# EAGLE design HexJacks (EAGLE 6.6.0)
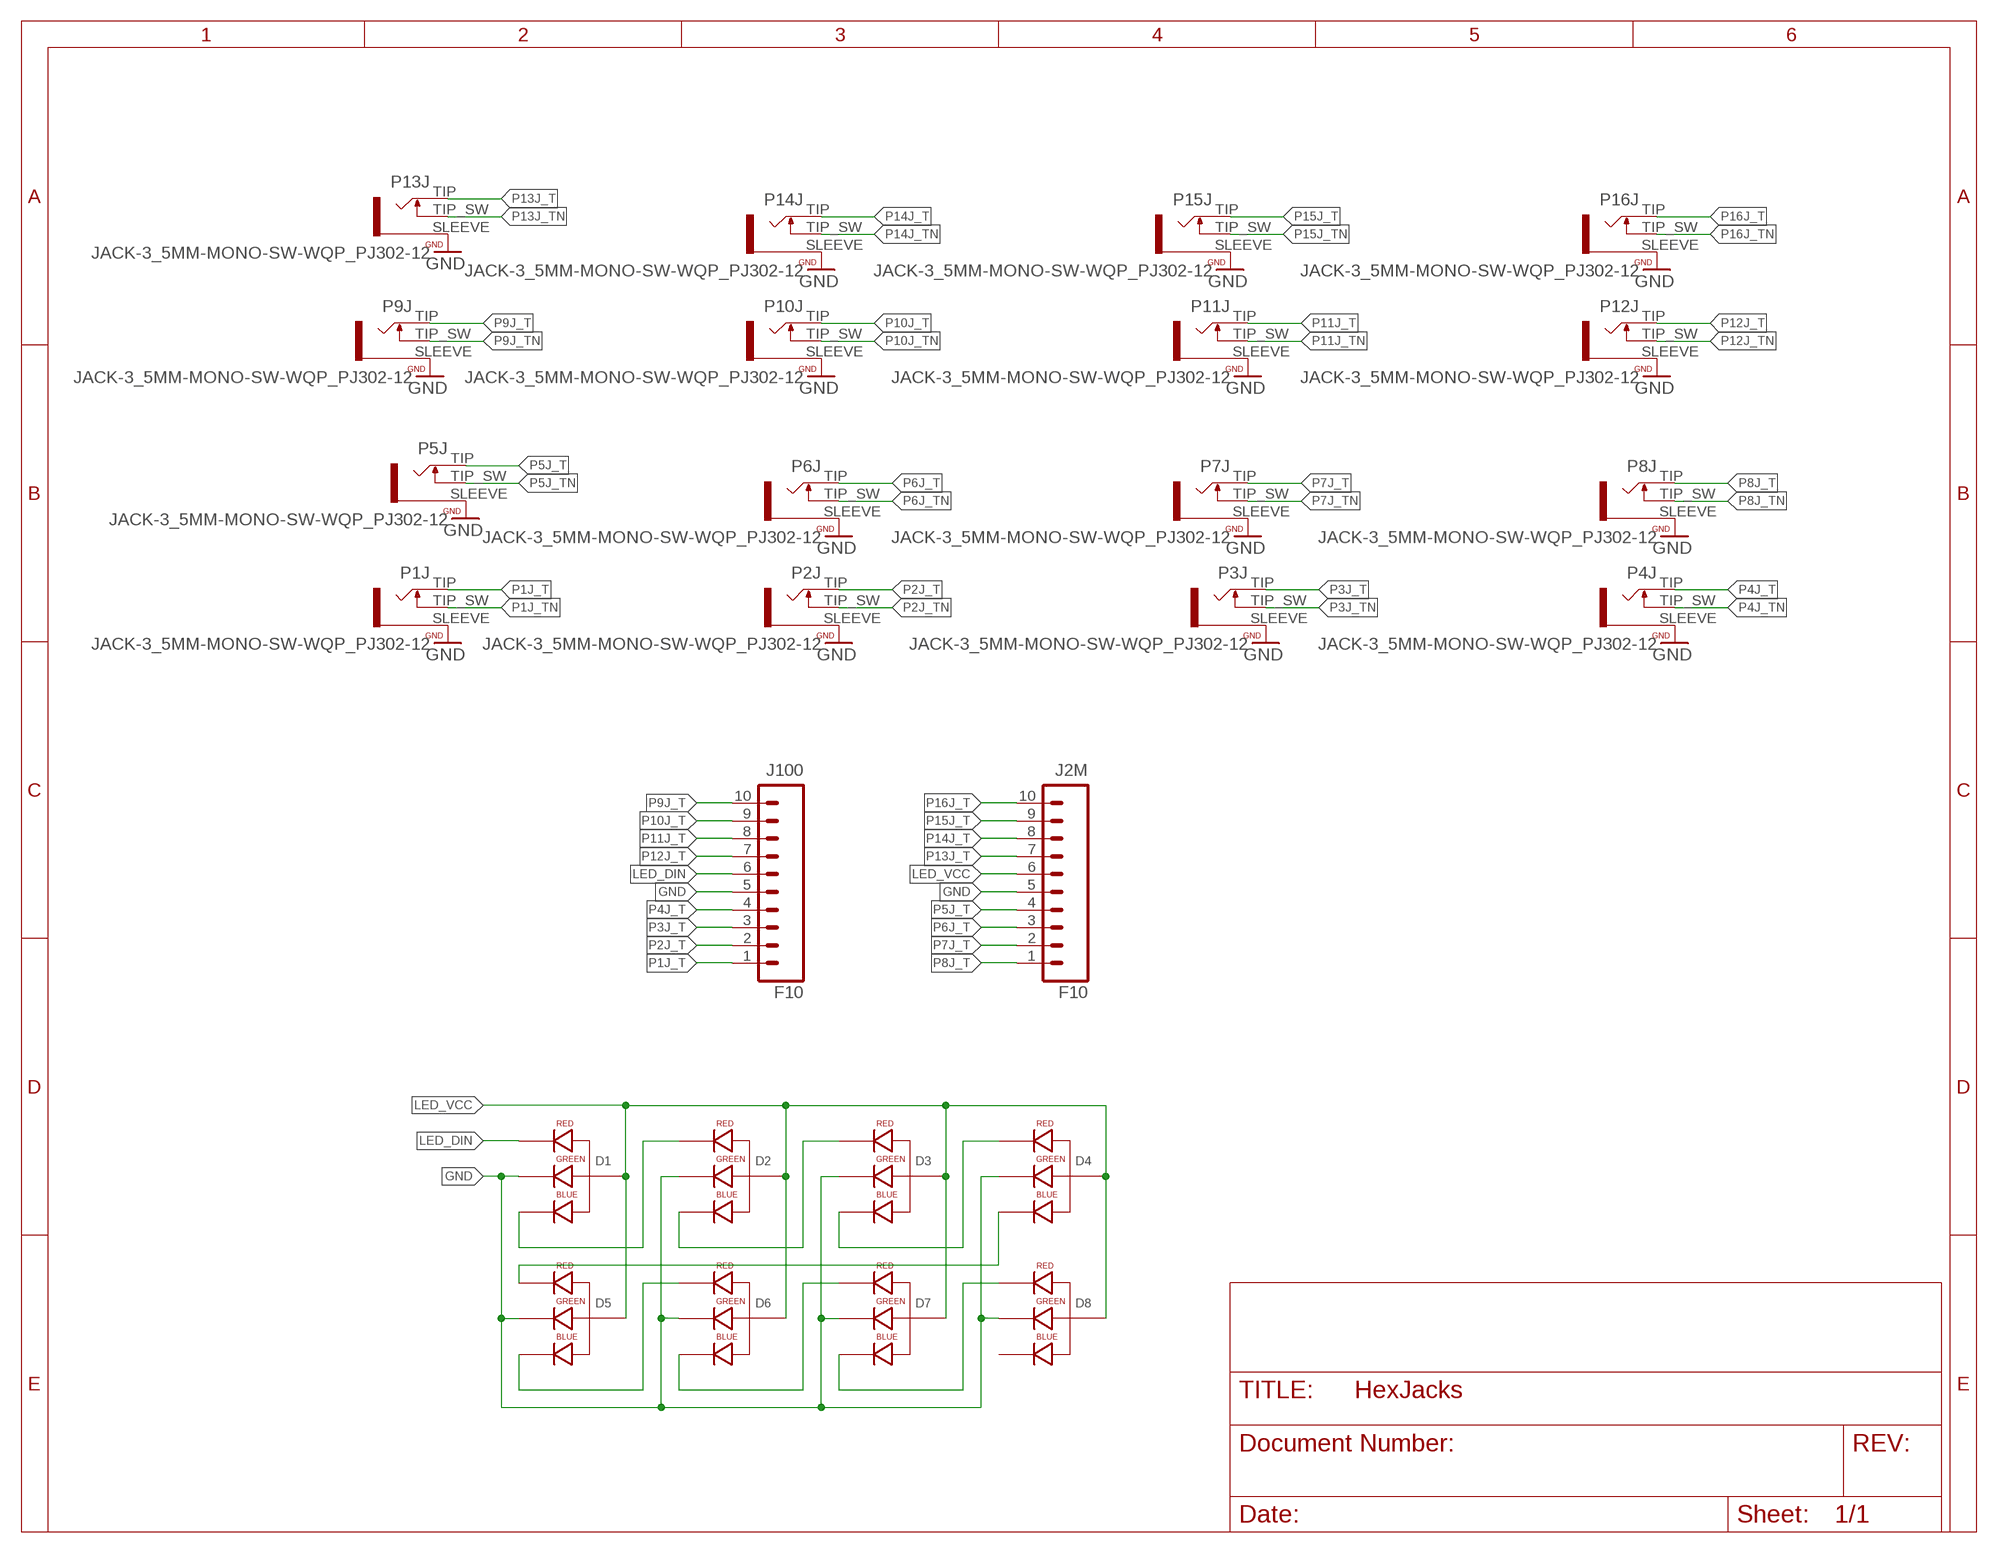
[diagram p0: schematic, sheet 1]

## Parts
D1  LED-RGB-CA-THRUCLEAR  [LED-RGB-THRU]
D2  LED-RGB-CA-THRUCLEAR  [LED-RGB-THRU]
D3  LED-RGB-CA-THRUCLEAR  [LED-RGB-THRU]
D4  LED-RGB-CA-THRUCLEAR  [LED-RGB-THRU]
D5  LED-RGB-CA-THRUCLEAR  [LED-RGB-THRU]
D6  LED-RGB-CA-THRUCLEAR  [LED-RGB-THRU]
D7  LED-RGB-CA-THRUCLEAR  [LED-RGB-THRU]
D8  LED-RGB-CA-THRUCLEAR  [LED-RGB-THRU]
J2M  F10  M10SILK_FEMALE_PTH  [1X10_OCTO]
J100  F10  M10SILK_FEMALE_PTH  [1X10_OCTO]
P1J  JACK-3_5MM-MONO-SW-WQP_PJ302-12  [WQP_PJ301M-12]
P2J  JACK-3_5MM-MONO-SW-WQP_PJ302-12  [WQP_PJ301M-12]
P3J  JACK-3_5MM-MONO-SW-WQP_PJ302-12  [WQP_PJ301M-12]
P4J  JACK-3_5MM-MONO-SW-WQP_PJ302-12  [WQP_PJ301M-12]
P5J  JACK-3_5MM-MONO-SW-WQP_PJ302-12  [WQP_PJ301M-12]
P6J  JACK-3_5MM-MONO-SW-WQP_PJ302-12  [WQP_PJ301M-12]
P7J  JACK-3_5MM-MONO-SW-WQP_PJ302-12  [WQP_PJ301M-12]
P8J  JACK-3_5MM-MONO-SW-WQP_PJ302-12  [WQP_PJ301M-12]
P9J  JACK-3_5MM-MONO-SW-WQP_PJ302-12  [WQP_PJ301M-12]
P10J  JACK-3_5MM-MONO-SW-WQP_PJ302-12  [WQP_PJ301M-12]
P11J  JACK-3_5MM-MONO-SW-WQP_PJ302-12  [WQP_PJ301M-12]
P12J  JACK-3_5MM-MONO-SW-WQP_PJ302-12  [WQP_PJ301M-12]
P13J  JACK-3_5MM-MONO-SW-WQP_PJ302-12  [WQP_PJ301M-12]
P14J  JACK-3_5MM-MONO-SW-WQP_PJ302-12  [WQP_PJ301M-12]
P15J  JACK-3_5MM-MONO-SW-WQP_PJ302-12  [WQP_PJ301M-12]
P16J  JACK-3_5MM-MONO-SW-WQP_PJ302-12  [WQP_PJ301M-12]

## Nets
GND: D1.3(GREEN_CATHODE) D2.3(GREEN_CATHODE) D3.3(GREEN_CATHODE) D4.3(GREEN_CATHODE) D5.3(GREEN_CATHODE) D6.3(GREEN_CATHODE) D7.3(GREEN_CATHODE) D8.3(GREEN_CATHODE) J2M.5 J100.5 P1J.SLEEVE P2J.SLEEVE P3J.SLEEVE P4J.SLEEVE P5J.SLEEVE P6J.SLEEVE P7J.SLEEVE P8J.SLEEVE P9J.SLEEVE P10J.SLEEVE P11J.SLEEVE P12J.SLEEVE P13J.SLEEVE P14J.SLEEVE P15J.SLEEVE P16J.SLEEVE
LED_DIN: D1.1(RED_CATHODE) J100.6
LED_VCC: D1.2(ANODE) D2.2(ANODE) D3.2(ANODE) D4.2(ANODE) D5.2(ANODE) D6.2(ANODE) D7.2(ANODE) D8.2(ANODE) J2M.6
N$1: D1.4(BLUE_CATHODE) D2.1(RED_CATHODE)
N$2: D2.4(BLUE_CATHODE) D3.1(RED_CATHODE)
N$3: D3.4(BLUE_CATHODE) D4.1(RED_CATHODE)
N$4: D4.4(BLUE_CATHODE) D5.1(RED_CATHODE)
N$5: D5.4(BLUE_CATHODE) D6.1(RED_CATHODE)
N$6: D6.4(BLUE_CATHODE) D7.1(RED_CATHODE)
N$7: D7.4(BLUE_CATHODE) D8.1(RED_CATHODE)
P1J_T: J100.1 P1J.TIP
P1J_TN: P1J.TIP_SW
P2J_T: J100.2 P2J.TIP
P2J_TN: P2J.TIP_SW
P3J_T: J100.3 P3J.TIP
P3J_TN: P3J.TIP_SW
P4J_T: J100.4 P4J.TIP
P4J_TN: P4J.TIP_SW
P5J_T: J2M.4 P5J.TIP
P5J_TN: P5J.TIP_SW
P6J_T: J2M.3 P6J.TIP
P6J_TN: P6J.TIP_SW
P7J_T: J2M.2 P7J.TIP
P7J_TN: P7J.TIP_SW
P8J_T: J2M.1 P8J.TIP
P8J_TN: P8J.TIP_SW
P9J_T: J100.10 P9J.TIP
P9J_TN: P9J.TIP_SW
P10J_T: J100.9 P10J.TIP
P10J_TN: P10J.TIP_SW
P11J_T: J100.8 P11J.TIP
P11J_TN: P11J.TIP_SW
P12J_T: J100.7 P12J.TIP
P12J_TN: P12J.TIP_SW
P13J_T: J2M.7 P13J.TIP
P13J_TN: P13J.TIP_SW
P14J_T: J2M.8 P14J.TIP
P14J_TN: P14J.TIP_SW
P15J_T: J2M.9 P15J.TIP
P15J_TN: P15J.TIP_SW
P16J_T: J2M.10 P16J.TIP
P16J_TN: P16J.TIP_SW
Unconnected: D8.4(BLUE_CATHODE)

## Library data of the parts
D1-D8 = halcyonmod_Optoelectronics:LED-RGB-CA-THRU: RGB Through-hole common anode SparkFun store front COM-10821 (diffuse) COM-10820 (clear); PROD_ID: DIO-10631
J2M J100 = oXo_Connectors:M10: Header 10 Standard 10-pin 0.1" header. Use with straight break away headers (SKU : PRT-00116), right angle break away headers (PRT-00553), swiss pins (PRT-00743), machine pins (PRT-00117), and female headers (PRT-00115).; PROD_ID: CONN-11563
P1J P2J P3J P4J P5J P6J P7J P8J P9J P10J P11J P12J P13J P14J P15J P16J = oXo_Connectors:JACK-3_5MM-MONO-SW: Jack, 3.5mm, RIght Angle, Though-Hole

## Board
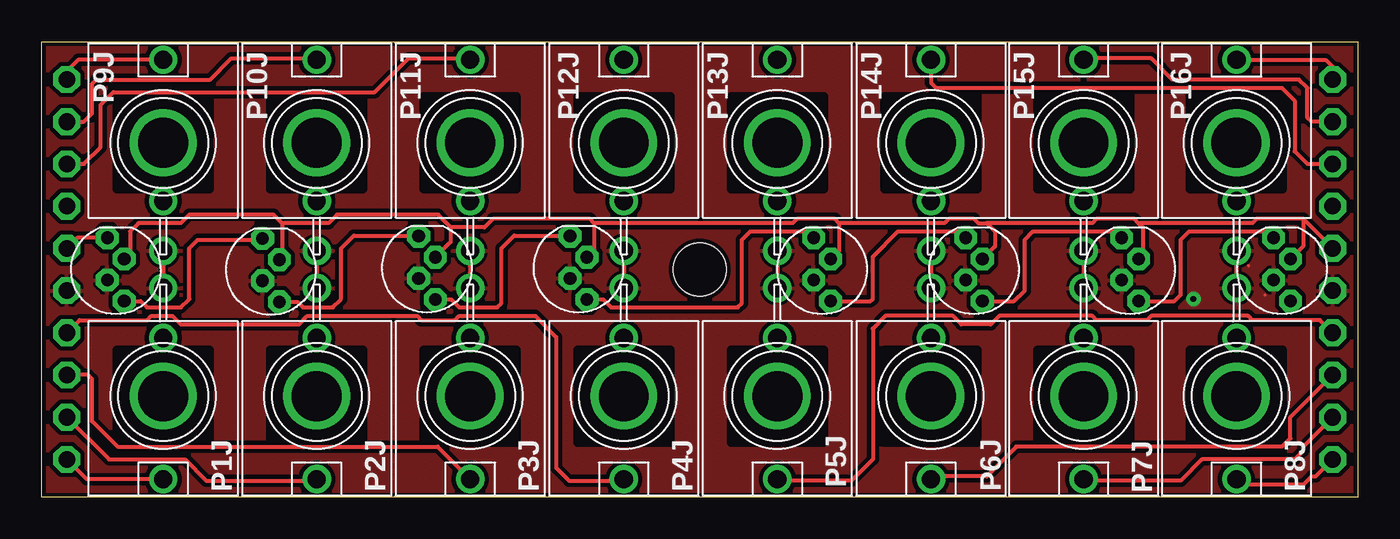
[diagram p1: board, top side]
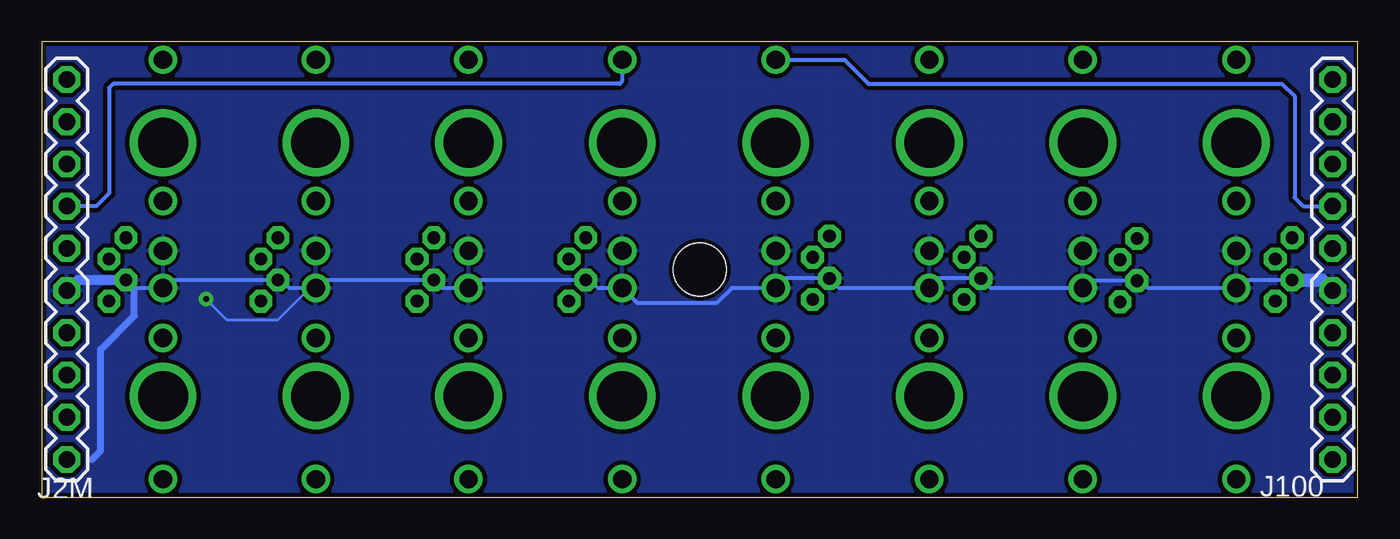
[diagram p2: board, bottom side, seen from below]

Size 79.25 x 27.43 mm. Coordinates in mm from the lower left corner, seen from the top.
Outline: 79.25,0 0,0 0,27.43 79.25,27.43 79.25,0
Copper layers (1*16): Top 0.035mm / dielectric 1.5mm / Bottom 0.035mm
Design rules "PatternAgents_7mil": minimum track width 7mil, minimum drill 14mil, track to track 7mil, track to pad 7mil, pad to pad 7mil, via to via 7mil, smd to smd 7mil, copper to edge 7mil, drill to drill 7mil, minimum pad ring 12mil, minimum via ring 10mil, stop-mask expansion 4mil, vias tented up to drill 25mil, thermal gap 7mil
Holes 3.2 mm at 39.62,13.72

### Footprints (pad centres in the part's own frame; a part is rotated, then mirrored left to right if it is on the bottom)
LED-RGB-THRU = drill 0.762 pad 0.889 octagon: 1 1.905,0.508; 2 0.635,-0.508; 3 -0.635,0.508; 4 -1.905,-0.508
1X10_OCTO = drill 1 octagon: 1 0,0; 2 2.54,0; 3 5.08,0; 4 7.62,0; 5 10.16,0; 6 12.7,0; 7 15.24,0; 8 17.78,0; 9 20.32,0; 10 22.86,0
WQP_PJ301M-12 = drill 3: HOLE 0,0 | drill 1.1: SLEEVE 0,-6.5; TIP 0,5; TIP_SW 0,-3.5

### Placement (x,y rotation side)
D1  4.47,13.72 90 top
D2  13.81,13.67 90 top
D3  23.2,13.82 90 top
D4  32.33,13.82 90 top
D5  46.99,13.72 90 top
D6  56.13,13.72 90 top
D7  65.53,13.72 90 top
D8  74.68,13.72 90 top
J2M  77.72,2.29 90 bottom
J100  1.52,2.29 90 bottom
P1J  7.32,6.1 180 top
P2J  16.56,6.1 180 top
P3J  25.8,6.1 180 top
P4J  35.05,6.1 180 top
P5J  44.29,6.1 180 top
P6J  53.54,6.1 180 top
P7J  62.73,6.1 180 top
P8J  71.93,6.1 180 top
P9J  7.32,21.34 0 top
P10J  16.56,21.34 0 top
P11J  25.8,21.34 0 top
P12J  35.05,21.34 0 top
P13J  44.29,21.34 0 top
P14J  53.54,21.34 0 top
P15J  62.73,21.34 0 top
P16J  71.93,21.34 0 top

### Tracks (layer width: path | path; a pad name or v marks a point on that pad's centre or on a via)
GND  (via drill 0.36)
  Top 0.178: 73.66,12.19 | 72.64,13.97 72.67,13.94 | 73.66,13.21 73.66,13.14
  Top 0.254: P14J.SLEEVE P6J.SLEEVE | P15J.SLEEVE P7J.SLEEVE | P16J.SLEEVE P8J.SLEEVE | P13J.SLEEVE P5J.SLEEVE | P12J.SLEEVE P4J.SLEEVE | P11J.SLEEVE P3J.SLEEVE | P10J.SLEEVE P2J.SLEEVE | P9J.SLEEVE P1J.SLEEVE
  Bottom 0.178: v69.34,11.94 68.07,10.67 65.02,10.67 63.25,12.45 62.99,12.45 62.74,12.7 | 62.74,12.7 P7J.SLEEVE | 62.74,12.7 62.86,12.72
  Bottom 0.254: D1.3 6.84,13.08 P1J.SLEEVE 12.61,12.6 D2.3 16.12,13.04 P2J.SLEEVE 22.11,12.6 D3.3 25.22,13.18 P3J.SLEEVE 31.23,12.6 D4.3 34.47,13.18 P4J.SLEEVE 37.7,12.6 38.61,11.68 43.38,11.68 P5J.SLEEVE 45.74,12.6 D5.3 53.06,13.08 P6J.SLEEVE 55.14,12.6 D6.3 62.25,13.08 P7J.SLEEVE 64.28,12.6 D7.3 71.45,13.08 P8J.SLEEVE 73.68,12.6 D8.3
  Bottom 0.406: 76.2,2.29 75.69,2.79 75.69,8.89 73.66,10.92 73.66,12.57 D8.3
  Bottom 0.61: D8.3 77.09,13.08 J2M.5
  Bottom 0.813: D1.3 2.16,13.08 J100.5
  pour Bottom (isolate 0.254, hatched): 0,0 0,27.43 79.25,27.43 79.25,0
  pour Top (isolate 0.254, hatched): 0,0 0,27.43 79.25,27.43 79.25,0
LED_DIN
  Top 0.254: D1.1 2.16,15.62 J100.6
LED_VCC
  Top 0.254: J2M.6 75.95,16.76 | 75.95,16.76 73.15,16.76 72.9,16.51 66.04,16.51 | 66.04,16.51 65.79,16.76 63.5,16.76 63.25,16.51 56.9,16.51 | 48.01,16.51 54.36,16.51 54.61,16.76 56.13,16.76 56.39,16.51 56.9,16.51 | 48.01,16.51 47.75,16.76 45.47,16.76 45.21,16.51 33.27,16.51 | 33.27,16.51 33.02,16.76 27.18,16.76 26.67,16.26 24.64,16.26 | 24.64,16.26 23.88,17.02 17.78,17.02 17.27,16.51 14.48,16.51 | 14.48,16.51 13.97,17.02 8.89,17.02 8.38,16.51 5.84,16.51 5.33,16 5.33,14.71 D1.2 | 14.48,16.51 14.48,14.71 D2.2 | 24.64,16.26 24.64,15.38 D3.2 | 33.27,16.51 33.27,14.89 D4.2 | 48.01,16.51 48.01,14.86 D5.2 | 75.95,16.76 75.95,15.11 D8.2 | 66.04,16.51 66.29,16.26 66.29,14.61 D7.2 | 56.9,16.51 57.4,16 57.4,15.11 D6.2
N$1
  Top 0.254: D1.4 5.97,11.81 6.35,11.43 8.38,11.43 8.89,11.94 8.89,14.99 9.4,15.49 12.97,15.49 D2.1
N$2
  Top 0.254: D2.4 15.41,11.77 15.75,11.43 17.53,11.43 18.03,11.94 18.03,14.99 18.8,15.75 22.67,15.75 D3.1
N$3
  Top 0.254: D4.1 31.79,15.75 28.45,15.75 27.69,14.99 27.69,11.68 27.43,11.43 25.15,11.43 24.66,11.91 D3.4
N$4
  Top 0.254: D4.4 33.81,11.91 34.29,11.43 41.91,11.43 42.16,11.68 42.16,15.49 42.67,16 46.1,16 D5.1
N$5
  Top 0.254: D5.4 49.91,11.81 50.04,11.94 50.04,14.48 51.56,16 55.25,16 D6.1
N$6
  Top 0.254: D6.4 58.55,11.81 59.18,12.45 59.18,15.49 59.69,16 64.64,16 D7.1
N$7
  Top 0.254: D7.4 68.2,11.81 68.58,12.19 68.58,15.49 69.09,16 73.79,16 D8.1
P1J_T
  Top 0.254: P1J.TIP 2.71,1.1 J100.1
P2J_T
  Top 0.254: P2J.TIP 16.48,1.02 9.91,1.02 8.64,2.29 4.06,2.29 J100.2
P3J_T
  Top 0.254: P3J.TIP 23.85,3.05 4.57,3.05 3.05,4.57 3.05,7.11 2.79,7.37 J100.3
P4J_T
  Top 0.254: P4J.TIP 34.97,1.02 31.75,1.02 30.99,1.78 30.99,9.65 29.72,10.92 25.15,10.92 24.89,10.67 22.86,10.67 22.61,10.92 16,10.92 15.49,10.41 8.38,10.41 7.87,10.92 6.6,10.92 6.35,10.67 2.29,10.67 J100.4
P5J_T
  Top 0.254: P5J.TIP 44.37,1.02 48.77,1.02 50.04,2.29 50.04,10.16 50.8,10.92 54.86,10.92 55.37,10.41 57.15,10.41 57.66,10.92 63.25,10.92 63.5,10.67 66.55,10.67 66.8,10.92 72.64,10.92 72.9,10.67 76.96,10.67 J2M.4
P6J_T
  Top 0.254: P6J.TIP 53.72,1.27 56.9,1.27 58.67,3.05 74.68,3.05 75.18,3.56 75.18,4.83 J2M.3
P7J_T
  Top 0.254: P7J.TIP 62.81,1.02 68.58,1.02 69.85,2.29 75.44,2.29 75.95,2.79 75.95,3.05 J2M.2
P8J_T
  Top 0.254: P8J.TIP 72.27,0.76 75.95,0.76 76.45,1.27 76.71,1.27 J2M.1
P9J_T
  Top 0.254: P9J.TIP 2.21,26.34 1.52,25.65 J100.10
P10J_T
  Top 0.254: J100.9 2.54,22.61 3.05,23.11 3.05,24.89 3.3,25.15 10.16,25.15 11.43,26.42 16.48,26.42 P10J.TIP
P11J_T
  Top 0.254: J100.8 2.54,20.07 3.56,21.08 3.56,23.62 4.32,24.38 20.07,24.38 22.1,26.42 25.72,26.42 P11J.TIP
P12J_T
  Bottom 0.254: P12J.TIP 30.91,26.34 29.46,24.89 4.57,24.89 3.81,24.13 3.81,18.03 3.3,17.53 J100.7
P13J_T
  Bottom 0.254: P13J.TIP 44.29,25.05 44.45,24.89 74.93,24.89 75.18,24.64 75.18,18.29 75.95,17.53 J2M.7
P14J_T
  Top 0.254: P14J.TIP 53.54,24.94 53.85,24.64 74.68,24.64 75.44,23.88 75.44,20.83 76.2,20.07 J2M.8
P15J_T
  Top 0.254: J2M.9 76.45,22.61 76.2,22.86 76.2,24.64 75.69,25.15 68.07,25.15 66.8,26.42 62.81,26.42 P15J.TIP
P16J_T
  Top 0.254: P16J.TIP 77.3,26.34 77.72,25.91 J2M.10